# EAGLE design Adafruit SMT Datalogger Shield rev B (EAGLE 6.6.0)
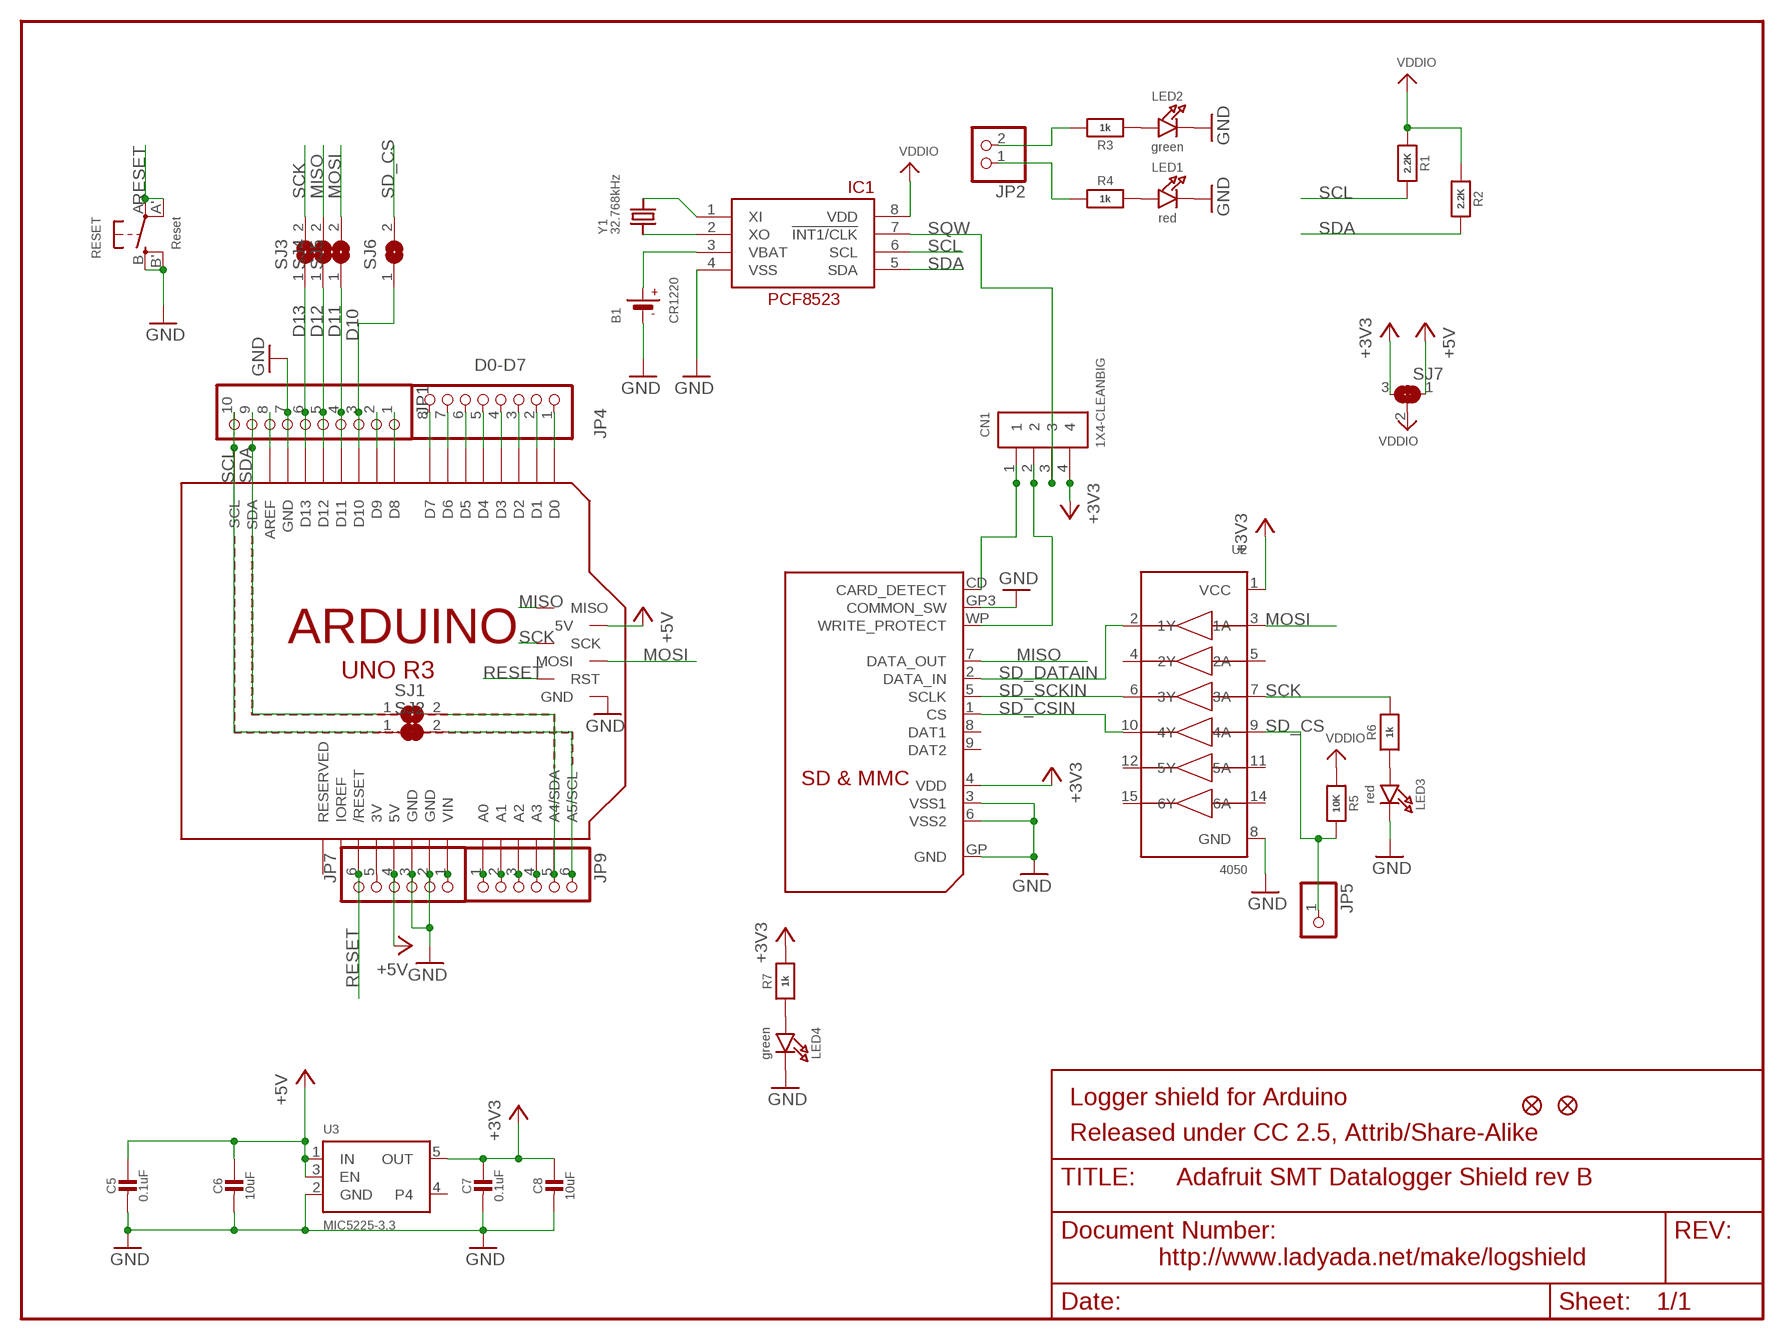
[diagram p0: schematic, sheet 1]

## Parts
B1  CR1220  BATTERYCR1220_SMT  [CR1220]
C5  0.1uF  CAP_CERAMIC0805-NOOUTLINE  [0805-NO]
C6  10uF  CAP_CERAMIC0805-NOOUTLINE  [0805-NO]
C7  0.1uF  CAP_CERAMIC0805-NOOUTLINE  [0805-NO]
C8  10uF  CAP_CERAMIC0805-NOOUTLINE  [0805-NO]
CN1  1X4-CLEANBIG  [1X04-CLEANBIG]
FID1  FIDUCIAL""  [FIDUCIAL_1MM]
FID3  FIDUCIAL""  [FIDUCIAL_1MM]
IC1  RTC_PCF8523T  [SOIC8_150MIL]
JP1  HEADER-1X1070MIL  [1X10_ROUND70]
JP2  HEADER-1X2ROUND  [1X02_ROUND]
JP4  D0-D7  PINHD-1X8BIG  [1X08-BIG]
JP5  HEADER-1X1ROUND  [1X01_ROUND]
JP7  PINHD-1X6B  [1X06-BIG]
JP9  PINHD-1X6B  [1X06-BIG]
LED1  red  LED0805_NOOUTLINE  [CHIPLED_0805_NOOUTLINE]
LED2  green  LED0805_NOOUTLINE  [CHIPLED_0805_NOOUTLINE]
LED3  red  LED0805_NOOUTLINE  [CHIPLED_0805_NOOUTLINE]
LED4  green  LED0805_NOOUTLINE  [CHIPLED_0805_NOOUTLINE]
M1  ARDUINO_R3_ICSP  [ARDUINOR3_ICSP]
R1  2.2K  RESISTOR0805_NOOUTLINE  [0805-NO]
R2  2.2K  RESISTOR0805_NOOUTLINE  [0805-NO]
R3  1k  RESISTOR0805_NOOUTLINE  [0805-NO]
R4  1k  RESISTOR0805_NOOUTLINE  [0805-NO]
R5  10K  RESISTOR0805_NOOUTLINE  [0805-NO]
R6  1k  RESISTOR0805_NOOUTLINE  [0805-NO]
R7  1k  RESISTOR0805_NOOUTLINE  [0805-NO]
RESET  Reset  SWITCH_TACT_SMT  [EVQ-Q2]
SJ1  SOLDERJUMPER  [SOLDERJUMPER_ARROW_NOPASTE]
SJ2  SOLDERJUMPER  [SOLDERJUMPER_ARROW_NOPASTE]
SJ3  SOLDERJUMPER  [SOLDERJUMPER_ARROW_NOPASTE]
SJ4  SOLDERJUMPER  [SOLDERJUMPER_ARROW_NOPASTE]
SJ5  SOLDERJUMPER  [SOLDERJUMPER_ARROW_NOPASTE]
SJ6  SOLDERJUMPERCLOSED  [SOLDERJUMPER_CLOSEDWIRE]
SJ7  SOLDERJUMPER_2WAY  [SOLDERJUMPER_2WAY_OPEN_NOPASTE]
U2  4050  74HC4050D  [SOIC16]
U3  MIC5225-3.3  VREG_SOT23-5  [SOT23-5]
U$2  SDMMC06132  [06132]
Y1  32.768kHz  CRYSTAL8.0X3.8  [CRYSTAL_8X3.8]

## Nets
3.3V: JP7.5 M1.3V
+3V3: C7.1 C8.1 CN1.4 R7.2 SJ7.3 U2.1(VCC) U3.5(OUT) U$2.4(VDD)
+5V: C5.1 C6.1 JP7.4 M1.5V M1.5V_ICSP(5V) SJ7.1 U3.1(IN) U3.3(EN)
A4: JP9.5 M1.A4(A4/SDA) SJ1.2
A5: JP9.6 M1.A5(A5/SCL) SJ2.2
D10: JP1.3 M1.D10 SJ6.1
D11: JP1.4 M1.D11 SJ5.1
D12: JP1.5 M1.D12 SJ4.1
D13: JP1.6 M1.D13 SJ3.1
GND: B1.- C5.2 C6.2 C7.2 C8.2 IC1.4(VSS) JP1.7 JP7.2 JP7.3 LED1.C LED2.C LED3.C LED4.C M1.GND M1.GND@1(GND) M1.GND@2(GND) M1.GND@3(GND) RESET.B'(S1) RESET.B(S) U2.8(GND) U3.2(GND) U$2.3(VSS1) U$2.6(VSS2) U$2.GP3(COMMON_SW) U$2.GP(GND)
MISO: M1.MISO SJ4.2 U$2.7(DATA_OUT)
MOSI: M1.MOSI SJ5.2 U2.3(1A)
N$1: LED1.A R4.2
N$2: IC1.2(XO) Y1.P$1
N$3: IC1.1(XI) Y1.P$4
N$4: LED2.A R3.1
N$5: LED3.A R6.1
N$15: JP7.1 M1.VIN
N$17: JP2.2 R3.2
N$20: JP2.1 R4.1
N$87: JP4.1 M1.D0
N$88: JP4.2 M1.D1
N$89: JP4.3 M1.D2
N$90: JP4.4 M1.D3
N$98: JP4.5 M1.D4
N$99: JP4.6 M1.D5
N$100: JP4.7 M1.D6
N$101: JP4.8 M1.D7
N$108: JP1.8 M1.AREF
N$110: JP1.2 M1.D9
N$111: JP1.1 M1.D8
N$150: LED4.A R7.1
N$154: JP9.1 M1.A0
N$164: JP9.2 M1.A1
N$181: JP9.3 M1.A2
N$182: JP9.4 M1.A3
RESET: JP7.6 M1.RESET(/RESET) M1.RESET_ICSP(RST) RESET.A'(P1) RESET.A(P)
SCK: M1.SCK R6.2 SJ3.2 U2.7(3A)
SCL: IC1.6(SCL) JP1.10 M1.SCL R1.2 SJ2.1
SD_CD: CN1.1 U$2.CD(CARD_DETECT)
SD_CS: JP5.1 R5.2 SJ6.2 U2.9(4A)
SD_CSIN: U2.10(4Y) U$2.1(CS)
SD_DATAIN: U2.2(1Y) U$2.2(DATA_IN)
SD_SCKIN: U2.6(3Y) U$2.5(SCLK)
SD_WP: CN1.2 U$2.WP(WRITE_PROTECT)
SDA: IC1.5(SDA) JP1.9 M1.SDA R2.2 SJ1.1
SQW: CN1.3 IC1.7(!INT1/CLK)
VBAT: B1.+$1(+) IC1.3(VBAT)
VDDIO: IC1.8(VDD) R1.1 R2.1 R5.1 SJ7.2
Unconnected: M1.IOREF M1.RESERVED U2.4(2Y) U2.5(2A) U2.11(5A) U2.12(5Y) U2.14(6A) U2.15(6Y) U3.4 U$2.8(DAT1) U$2.9(DAT2)

## Notes on the sheet
- Logger shield for Arduino
- Released under CC 2.5, Attrib/Share-Alike
- http://www.ladyada.net/make/logshield

## Library data of the parts
B1 = microbuilder:BATTERY: CR1220 SMT - Digikey: 3001K-ND CD2032 BAT-HLD-001 - Digikey: BAT-HLD-001-ND
C5-C8 = microbuilder:CAP_CERAMIC: Ceramic Capacitors For new designs, use the packages preceded by an '_' character since they are more reliable: The following footprints should be used on most boards: _0402 - Standard footprint for regular board layouts _0603 - Standard footprint for regular board layouts _0805 - Standard footprint for regular board layouts _1206 - Standard footprint for regular board layouts For extremely tight-pitch boards where space is at a premium, the following 'micro-pitch' footprints can be used (smaller pads, no silkscreen outline, etc.): _0402MP - Micro-pitch footprint for very dense/compact boards _0603MP - Micro-pitch footprint for very dense/compact boards _0805MP - Micro-pitch footprint for very dense/compact boards _1206MP - Micro-pitch footprint for very dense/compact boards
CN1 = adafruit:1X4: 4-pin connector
FID1 FID3 = microbuilder:FIDUCIAL: Fiducial Alignment Points Various fiducial points for machine vision alignment.; BOM: EXCLUDE
IC1 = microbuilder:RTC_PCF8523
JP1 = microbuilder:HEADER-1X10: PIN HEADER
JP2 = microbuilder:HEADER-1X2: PIN HEADER
JP4 = adafruit:PINHD-1X8: PIN HEADER
JP5 = microbuilder:HEADER-1X1: PIN HEADER
JP7 JP9 = adafruit:PINHD-1X6: PIN HEADER
LED1-LED4 = microbuilder:LED: LED 0603 - 0603 Surface Mount Package 2mA: Green LED - Low Power (3.9mcd, 2ma, 1.7Vf) - Digikey: 475-2709-2-ND Orange LED - Low Power (9.8mcd, 2ma, 1.8Vf) - Digikey: 475-1194-2-ND Red LED - Low Power (5mcd, 2ma, 1.8Vf) - Digikey: 475-1195-2-ND Yellow LED - Low Power (7mcd, 2ma, 1.8Vf) - Digikey: 475-1196-2-ND 5mA: Blue LED - Low Power (17mcd, 5ma, 2.9Vf) - Digikey: LNJ937W8CRACT-ND 0805 - 0805 Surface Mount Package 2mA: Red LED (8.8mcd, 2mA, 1.8Vf, Clear) - Low Power [Digikey: 475-2510-1-ND] Green LED (5mcd, 2mA, 1.8Vf, Clear) - Low Power [Digikey: 475-2730-1-ND] Yellow LED (11.3mcd, 2mA, 1.8Vf, Clear) - Low Power [Digikey: 475-2555-1-ND] 20mA: Red LED (104mcd, 20mA, Diffused) - LS R976 [Digikey: 475-1278-6-ND] Red LED (12mcd, 20mA, 2.0Vf, Clear) - APT2012EC [Digikey: 754-1128-1-ND] Green LED (15mcd, 20mA, 2.2Vf, Clear) - APT2012GC [Digikey: 754-1131-1-ND] Orange LED (160mcd, 20mA, 2.1Vf, Clear) - APT2012SECK [Digikey: 754-1130-1-ND] 1206 - 1206 Surface Mount Package Green LED (26mcd, 20mA, Diffused) - LG N971 [Digikey: 475-1407-6-ND] Red LED (15mcd, 20mA, Diffused) - LH N974 [Digikey: 475-1416-6-ND] Cree - Cree High-Power Surface Mount LEDs XPEBWT-L1-0000-00D50 - White 111lm 350mA 2.9Vf 6200K 110° XTEAWT-00-0000-00000LEE3 - White 114lm 350mA 2.85Vf 5000K 115° Everlight - Everlight 45-21 Series Surface Mount LEDs 45-21/QK2C-B2832AC2CB2/2T - Warm White 2000mcd 20mA 3.25Vf 3050K 120° 45-21/LK2C-B38452C4CB2/2T - Nuetral White 2000mcd 20mA 3.25Vf 4150K 120° 45-21/LK2C-B50634C6CB2/2T - Cold White 2200mcd 20mA 3.25Vf 5650K 120° PLCC2 Reverse Mount LS T77K-J1L2-1-0-2-R18-Z - Red 11.25mcd 2mA 1.8Vf 630nm 120° LO T77K-L1M2-24-Z - Orange 19.6mcd 2mA 1.8Vf 606nm 120° LY T77K-K2M1-26-Z - Yellow 15.7mcd 2mA 1.8Vf 587nm 120°
M1 = adafruit:ARDUINO_R3_ICSP
R1-R7 = microbuilder:RESISTOR: Resistors For new designs, use the packages preceded by an '_' character since they are more reliable: The following footprints should be used on most boards: _0402 - Standard footprint for regular board layouts _0603 - Standard footprint for regular board layouts _0805 - Standard footprint for regular board layouts _1206 - Standard footprint for regular board layouts For extremely tight-pitch boards where space is at a premium, the following 'micro-pitch' footprints can be used (smaller pads, no silkscreen outline, etc.): _0402MP - Micro-pitch footprint for very dense/compact boards _0603MP - Micro-pitch footprint for very dense/compact boards _0805MP - Micro-pitch footprint for very dense/compact boards _1206MP - Micro-pitch footprint for very dense/compact boards
RESET = microbuilder:SWITCH_TACT_SMT: SMT Tact Switches 6x6mm - Digikey: P12940SCT-ND KMR2 (4.6x2.8mm) - Digikey: 401-1426-1-ND EVQ-PQHB55 - Light Touch, 160GF (4.5x4.5mm) - Digikey: P8090SCT-ND KMT0 - KMT021 NGJ LHS (etc.) IP68/Waterproof - Digikey: CKN10289CT-ND
SJ1-SJ5 = microbuilder:SOLDERJUMPER: SMD Solder JUMPER Solder the two pads together to create a connection, or remove the solder to break it. REFLOW - Use this footprint for solder paste and reflow ovens. WAVE - Use this footprint for hand-soldering (larger pads). CLOSED - Has a trace between the two pads to ensure it is closed by default. The trace needs to be cut to disable the jumper, and can be closed again by creating a solder bridge between the two pads.; BOM: EXCLUDE
SJ6 = microbuilder:SOLDERJUMPER: SMD Solder JUMPER Solder the two pads together to create a connection, or remove the solder to break it. REFLOW - Use this footprint for solder paste and reflow ovens. WAVE - Use this footprint for hand-soldering (larger pads). CLOSED - Has a trace between the two pads to ensure it is closed by default. The trace needs to be cut to disable the jumper, and can be closed again by creating a solder bridge between the two pads.
SJ7 = microbuilder:SOLDERJUMPER_2WAY: 2-Way Solder Jumper
U2 = microbuilder:74HC4050D: 6-channel level shifter 74HC4050D - 2V-6V Supply SOIC16 Digikey: 74HC4050D,653-ND Mouser: 771-74HC4050D-T TSSOP16 Digikey: 296-9215-1-ND Mouser:
U3 = microbuilder:VREG_SOT23-5: SOT23-5 Fixed Voltage Regulators Part Current Out V Out V In V Dropout θJA (°C/W) TJ (°C) Digikey Part No. ADP121 150mA 3.3V 3.4-5.5V 0.09V @ 150mA -- -- ADP121-AUJZ33R7CT-ND ADP121 150mA 3.0V 3.1-5.5V 0.09V @ 150mA -- -- ADP121-AUJZ30R7CT-ND ADP122 300mA 3.3V 3.4-5.5V 0.085V @ 300mA -- -- ADP122AUJZ-3.3-R7CT-ND ADP1712 300mA 3.3V 3.5-5.5V 0.17V @ 300mA -- -- ADP1712AUJZ-3.3-R7TR-ND AP7311 (Low Cost) 150mA 3.3V 3.5-6V 0.15V @ 150mA -- -- AP7311-33WG-7DICT-ND LD39015M18R 150mA 1.8V 1.9V-5.5V 0.08V @ 100mA -- -- 497-6977-1-ND LP2985A-33DBVR 150mA 3.3V 3.3-16V 0.28V @ 150mA 206 150 296-18479-1-ND MCP1824T-3302E/OT 300mA 3.3V 3.5V-6V 0.2V @ 300mA -- -- MCP1824T-3302E/OTCT-ND MIC5205-2.5YM5 TR 150mA 2.5V 2.7-16V 0.165V @ 150mA -- -- 576-1257-2-ND MIC5205-3.0YM5 TR 150mA 3.0V 3.2V-16V 0.165V @ 150mA -- -- 576-1258-2-ND MIC5205-3.3YM5 TR 150mA 3.3V 3.5V-16V 0.165V @ 150mA -- -- 576-1259-2-ND TPS780330220 150mA 3.3V+2.2V 3.6-5.5V 250mV Max -- -- 296-23332-1-ND TDA3663/N1,135 100mA 3.3V 3.5-45V 0.18V @ 50mA -- -- 568-5343-1-ND Max operating temp can be calculated using θJA, TJ (max junction temperature), and power in watts. Set the "Maximum Ambient Temperature" until it reaches TJ ("Max Junction Temperature"), which is the absolute limit for safe use of the regulator: Heat Sink Temperature Calculator <http://www.daycounter.com/Calculators/Heat-Sink-Temperature-Calculator.phtml> For example, With 12V source into a 3.3V LP2985 and a 30mA load, we are dissipating (12V-3.3V) * 0.03A = 0.261W. With a θJA of 206 °C/W, a TJ of 150°C, and 261mW we can safely use the chip without a heat sink up to 75°C (=147.1°C Junction Temperature).
U$2 = microbuilder:SDMMC: SD MMC Card holder 4UCON part #06132 - easy to solder
Y1 = microbuilder:CRYSTAL: Crystals HC49UP - Surface Mount Crystal 4.0MHz 18pF +/-30ppm Surface Mount Crystal [Digikey: 535-9857-1-ND] 12.0 MHz Surface Mount Crystal [Digikey: 535-9869-6-ND] 25.0 MHz Surface Mount Crystal [Digikey: 535-9078-1-ND] 2.5 x 2.0mm - MEMs SMT Crystal 16.0 MHz 10pF 20ppm 2.5 x 2.0mm Crystal [Digikey -40-85°C: 535-10923-1-ND] 3.2 x 2.5mm - MEMs SMT Crystal 12.0 MHz 8pF 15ppm 3.2 x 2.5mm Crystal [Digikey: -10-70°C: 644-1047-1-ND -40-125°C: 644-1128-1-ND] 40~85°C cheaper: 644-1173-6-ND 16.0 MHz 8pF 15ppm 3.2 x 2.5mm Crystal [Digikey: -10-70°C: 644-1049-1-ND -40-125°C: 644-1129-2-ND]-40~85°C cheaper: 644-1175-6-ND 16.0 MHz 10pF 10ppm 3.2 x 2.5mm Crystal [Digikey: 644-1100-1-ND] 27.12 MHz 18pF 30ppm 3.2 x 2.5mm Crystal [Digikey: 887-1424-1-ND] 27.12MHz 10pF 10ppm 3.2 x 2.5mm Crystal [Digikey: 887-1329-1-ND] 4.9 x 1.8mm - MEMs SMT Crystal 32.768 KHz 12.5pF 20ppm 4.9 x 1.8mm Crystal [Digikey: SE2415CT-ND] 8.0 x 3.8mm - Surface Mount Crystal 32.768kHz 12.5pF 20ppm -40°C-85°C [Digikey: 535-9166-2-ND] Cylinder 32.768KHz Cylinder Crystal (2x6mm body) [Ex. Digikey: 300-8341-2-ND]

## Board
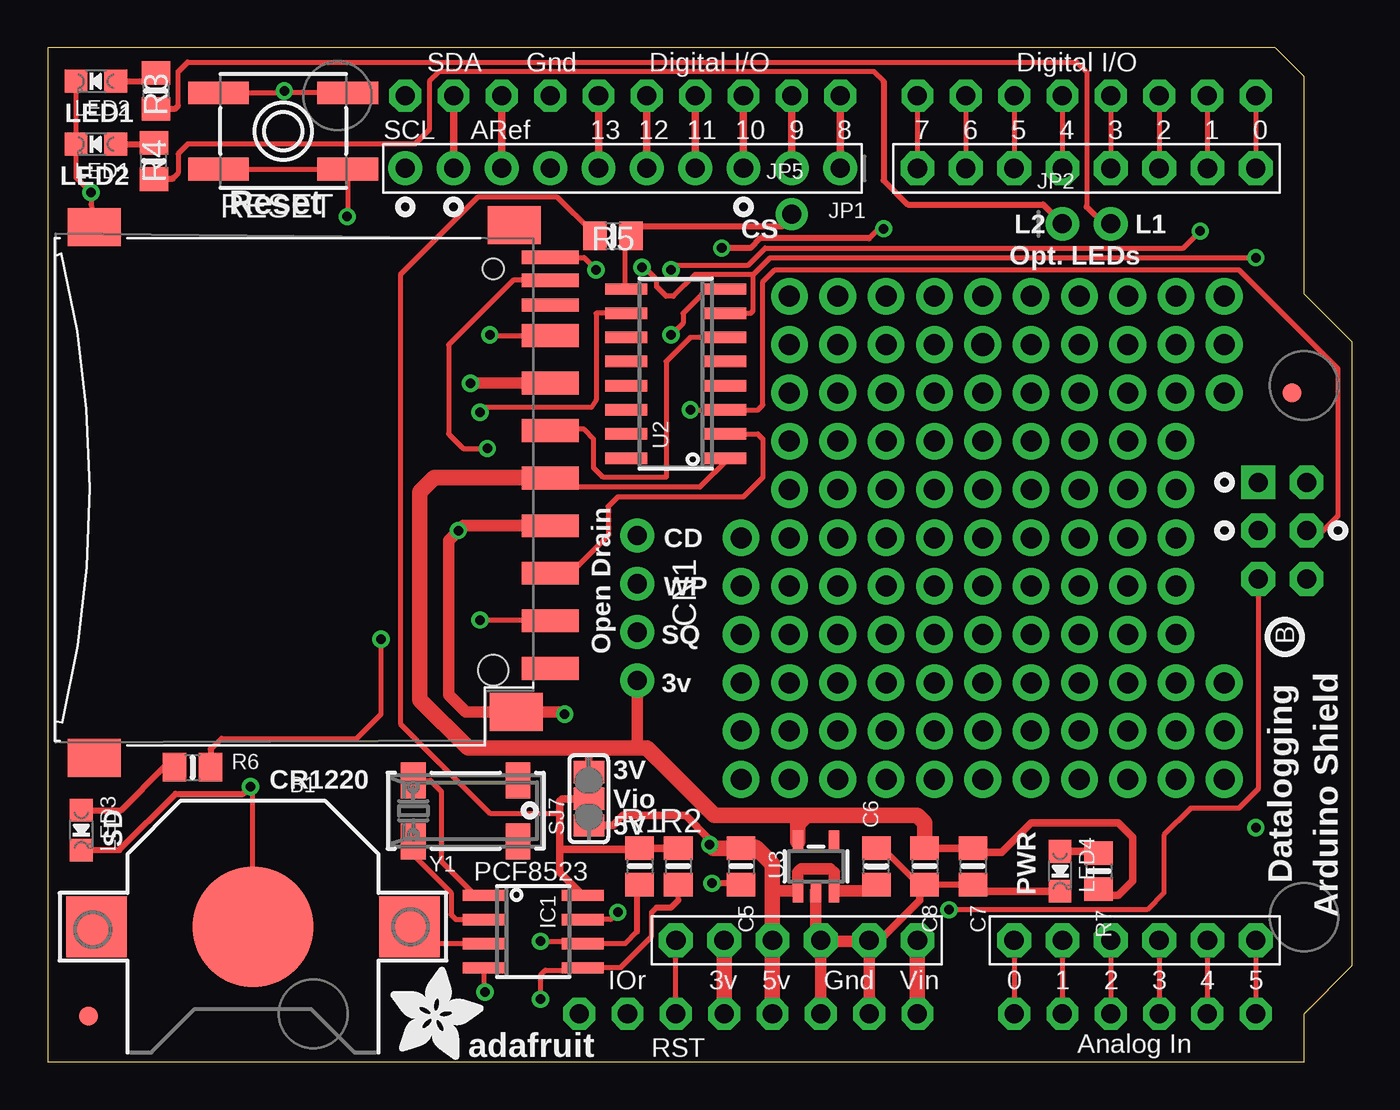
[diagram p1: board, top side]
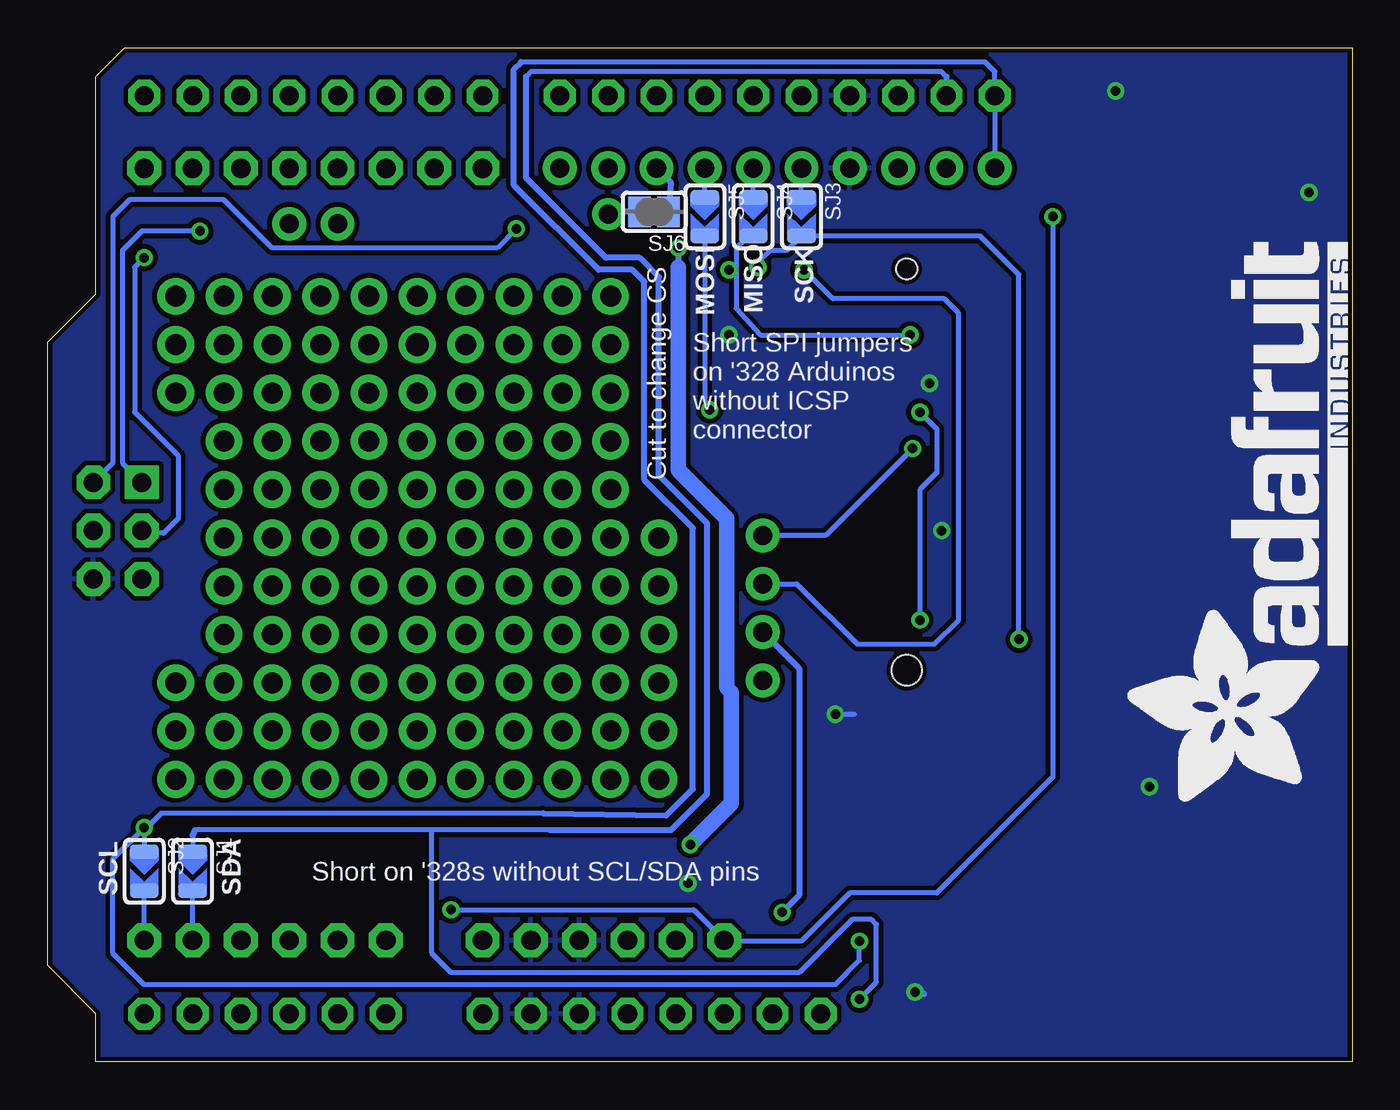
[diagram p2: board, bottom side, seen from below]

Size 68.58 x 53.34 mm. Coordinates in mm from the lower left corner, seen from the top.
Copper layers (1*16): Top 0.035mm / dielectric 1.5mm / Bottom 0.035mm
Design rules "adafruit": minimum track width 8mil, minimum drill 15.5mil, track to track 8mil, track to pad 8mil, pad to pad 8mil, via to via 8mil, smd to smd 8mil, copper to edge 10mil, drill to drill 8mil, minimum pad ring 10mil, minimum via ring 8mil, stop-mask expansion 2mil, vias tented up to drill 20mil, thermal gap 10mil

### Footprints (pad centres in the part's own frame; a part is rotated, then mirrored left to right if it is on the bottom)
CR1220 = smd 3.2 x 3.2: +$1 -8.225,0; +$2 8.225,0 | smd 6.35 x 6.35: - 0,0
0805-NO = smd 1.24 x 1.5: 1 -0.95,0; 2 0.95,0
1X04-CLEANBIG = drill 1.016 pad 1.778: 1 -3.81,0; 2 -1.27,0; 3 1.27,0; 4 3.81,0
FIDUCIAL_1MM = smd 1 x 1: 1 0,0
SOIC8_150MIL = smd 0.6 x 2.2: 1 -1.905,-2.6; 2 -0.635,-2.6; 3 0.635,-2.6; 4 1.905,-2.6; 5 1.905,2.6; 6 0.635,2.6; 7 -0.635,2.6; 8 -1.905,2.6
1X10_ROUND70 = drill 1 pad 1.778: 1 -11.43,0; 2 -8.89,0; 3 -6.35,0; 4 -3.81,0; 5 -1.27,0; 6 1.27,0; 7 3.81,0; 8 6.35,0; 9 8.89,0; 10 11.43,0
1X02_ROUND = drill 1 pad 1.778: 1 -1.27,0; 2 1.27,0
1X08-BIG = drill 1.016 pad 1.778 octagon: 1 -8.89,0; 2 -6.35,0; 3 -3.81,0; 4 -1.27,0; 5 1.27,0; 6 3.81,0; 7 6.35,0; 8 8.89,0
1X01_ROUND = drill 1 pad 1.676: 1 0,0
1X06-BIG = drill 1.016 pad 1.778 octagon: 1 -6.35,0; 2 -3.81,0; 3 -1.27,0; 4 1.27,0; 5 3.81,0; 6 6.35,0
CHIPLED_0805_NOOUTLINE = smd 1.2 x 1.2: A 0,-1.05; C 0,1.05
ARDUINOR3_ICSP = drill 1 pad 1.676 octagon: 3V 35.56,2.54; 5V 38.1,2.54; A0 50.8,2.54; A1 53.34,2.54; A2 55.88,2.54; A3 58.42,2.54; A4 60.96,2.54; A5 63.5,2.54; AREF 23.876,50.8; D0 63.5,50.8; D1 60.96,50.8; D2 58.42,50.8; D3 55.88,50.8; D4 53.34,50.8; D5 50.8,50.8; D6 48.26,50.8; D7 45.72,50.8; D8 41.656,50.8; D9 39.116,50.8; D10 36.576,50.8; D11 34.036,50.8; D12 31.496,50.8; D13 28.956,50.8; GND 26.416,50.8; GND@1 43.18,2.54; GND@2 40.64,2.54; IOREF 30.48,2.54; RESERVED 27.94,2.54; RESET 33.02,2.54; SCL 18.796,50.8; SDA 21.336,50.8; VIN 45.72,2.54 | drill 1 pad 1.778 octagon: 5V_ICSP 66.167,30.48; GND@3 66.167,25.4; MOSI 66.167,27.94; RESET_ICSP 63.627,25.4; SCK 63.627,27.94 | drill 1 pad 1.778 square: MISO 63.627,30.48
EVQ-Q2 = smd 3.2 x 1.2: A -3.4,-2; A' 3.4,-2; B -3.4,2; B' 3.4,2
SOLDERJUMPER_ARROW_NOPASTE = smd 0.762 x 1.524: 1 -1.016,0; 2 1.016,0
SOLDERJUMPER_CLOSEDWIRE = smd 1.168 x 1.6: 1 -0.762,0; 2 0.762,0 | smd 0.635 x 0.203: WIRE 0,0
SOLDERJUMPER_2WAY_OPEN_NOPASTE = smd 1.168 x 1.6: 1 -1.397,0; 2 0,0; 3 1.397,0
SOIC16 = smd 0.6 x 2.2: 1 -4.445,-2.6; 2 -3.175,-2.6; 3 -1.905,-2.6; 4 -0.635,-2.6; 5 0.635,-2.6; 6 1.905,-2.6; 7 3.175,-2.6; 8 4.445,-2.6; 9 4.445,2.6; 10 3.175,2.6; 11 1.905,2.6; 12 0.635,2.6; 13 -0.635,2.6; 14 -1.905,2.6; 15 -3.175,2.6; 16 -4.445,2.6
SOT23-5 = smd 0.55 x 1.2: 1 -0.95,-1.3; 2 0,-1.3; 3 0.95,-1.3; 4 0.95,1.3; 5 -0.95,1.3
06132 = smd 1.2 x 3: 1 6.9,0.9; 2 4.4,0.9; 3 1.9,0.9; 4 -0.6,0.9; 5 -3.1,0.9; 6 -5.6,0.9; 7 -8.1,0.9; 9 9.4,0.9 | smd 0.7 x 3: 8 -9.7,0.9; CD -11,0.9; WP -12.2,0.9 | smd 2 x 2.8: GP -13.8,-23.07; GP2 14.1,-23.07; GP3 11.7,-0.9; GP4 -13.9,-1 | hole 1.1: -11.6,-2.1 | hole 1.6: 9.5,-2.1
CRYSTAL_8X3.8 = smd 1.3 x 1.9: P$1 -2.75,-1.6; P$2 2.75,-1.6; P$3 2.75,1.6; P$4 -2.75,1.6

### Placement (x,y rotation side)
B1  10.79,7.11 180 top
C5  36.45,10.29 270 top
C6  43.56,10.29 90 top
C7  48.64,10.29 270 top
C8  46.1,10.29 270 top
CN1  30.99,23.88 270 top
FID1  2.16,2.41 0 top
FID3  65.41,35.18 0 top
IC1  25.53,6.86 270 top
JP1  30.23,46.99 180 top
JP2  54.61,44.07 0 top
JP4  54.61,46.99 180 top
JP5  39.12,44.58 0 top
JP7  39.37,6.4 180 top
JP9  57.15,6.4 0 top
LED1  2.54,48.26 90 top
LED2  2.54,51.56 90 top
LED3  1.78,12.19 180 top
LED4  53.21,10.03 180 top
M1  0,0 0 top
R1  31.11,10.29 270 top
R2  33.15,10.29 270 top
R3  5.69,51.06 270 top
R4  5.59,47.37 90 top
R5  29.72,43.43 0 top
R6  7.62,15.49 0 top
R7  55.24,10.03 270 top
RESET  12.39,48.95 0 top
SJ1  60.96,10.03 270 bottom
SJ2  63.5,10.03 270 bottom
SJ3  28.96,44.45 270 bottom
SJ4  31.5,44.45 270 bottom
SJ5  34.04,44.45 270 bottom
SJ6  36.7,44.7 180 bottom
SJ7  28.45,13.84 90 top
U2  33.02,36.2 90 top
U3  40.39,10.29 0 top
U$1  [ADAFRUIT_TEXT_30MM]  0.25,13.46 90 bottom
U$2  25.53,30.1 270 top
U$3  [PCBFEAT-REV-040]  65.02,22.35 90 top
U$5  [ADAFRUIT_5MM]  18.03,0.13 0 top
Y1  21.97,13.21 0 top

### Tracks (layer width: path | path; a pad name or v marks a point on that pad's centre or on a via)
3.3V
  Top 0.813: JP7.5 M1.3V
+3V3
  Top 0.254: U$2.4 26.21,30.73 27.18,30.73 27.69,30.23 34.29,30.23 35.75,31.68 U2.1
  Top 0.406: C8.1 C7.1 48.84,11.03 50.15,11.03 51.69,12.57 56.26,12.57 57.02,11.81 57.02,9.53 56.26,8.76 55.56,8.76 R7.2 | SJ7.3 28.45,16.51
  Top 0.61: CN1.4 30.99,16.51
  Top 0.813: 39.88,12.95 45.72,12.95 46.1,12.57 C8.1 | 39.88,12.95 39.44,12.51 U3.5 | 26.21,30.73 20.32,30.73 19.56,29.97 19.56,19.05 22.1,16.51 28.45,16.51 30.99,16.51 31.5,16.51 35.05,12.95 39.88,12.95
+5V  (via drill 0.5)
  Top 0.254: 43.18,43.31 43.69,43.81 v43.94,43.81
  Top 0.305: 37.22,11.29 37.17,11.24 C5.1 | 43.18,43.31 37.47,43.31 36.96,42.8 35.49,42.8 v35.43,42.8
  Top 0.406: SJ7.1 29.72,12.45 30.23,12.95 33.53,12.95 34.8,11.68 v34.8,11.43
  Top 0.61: 38.2,8.99 U3.1 39.44,9.97 39.62,10.16 41.15,10.16 41.34,9.97 U3.3 43.21,8.99 C6.1
  Top 0.813: M1.5V JP7.4 38.1,8.89 | 38.1,8.89 38.1,10.41 37.22,11.29 | 38.2,8.99 38.1,8.89 | C5.1 34.99,11.24 v34.8,11.43
  Bottom 0.254: M1.5V_ICSP 65.15,31.5 65.15,44.45 64.26,45.34 59.31,45.34 56.77,42.8 44.96,42.8 v43.94,43.81
  Bottom 0.305: v35.43,42.8 35.43,41.78
  Bottom 0.813: v34.8,11.43 32.64,13.59 32.64,19.43 32.89,19.68 32.89,28.57 35.43,31.11 35.43,41.78
A4
  Top 0.254: JP9.5 M1.A4
  Bottom 0.254: JP9.5 SJ1.2
A5
  Top 0.254: JP9.6 M1.A5
  Bottom 0.254: JP9.6 SJ2.2
D10
  Top 0.254: 36.7,46.91 36.65,46.91 JP1.3
  Top 0.406: M1.D10 JP1.3
  Bottom 0.305: SJ6.1 35.81,46.23 JP1.3
D11
  Top 0.406: M1.D11 JP1.4
  Bottom 0.254: SJ5.1 JP1.4
D12
  Top 0.406: JP1.5 M1.D12
  Bottom 0.254: SJ4.1 JP1.5
D13
  Top 0.406: JP1.6 M1.D13
  Bottom 0.254: SJ3.1 JP1.6
GND  (via drill 0.5)
  Top 0.254: 22.21,35.7 v22.23,35.69 | B1.- 10.79,14.35 v10.67,14.48 | 40.39,6.66 JP7.3 | LED2.C LED1.C 1.49,46.52 v2.29,45.72 2.29,45.09 U$2.GP | RESET.B 12.35,50.95 v12.45,51.05 12.55,50.95 RESET.B' | U2.8 34.67,40.64 33.4,39.37 33.4,38.86 v32.77,38.23 | IC1.4 22.93,3.74 v22.99,3.68
  Top 0.305: LED3.C 3.78,11.14 6.73,14.1 10.29,14.1 v10.67,14.48 | C5.2 35.88,9.4 v34.92,9.4 | C7.2 C8.2 45.78,9.66 45.46,9.66 44.07,11.05 43.75,11.05 C6.2
  Top 0.406: 53.16,9.03 LED4.C 48.99,8.98 C7.2 | JP7.2 43.74,6.4 45.85,8.51 45.85,9.08 C8.2
  Top 0.61: U$2.6 22.21,35.7 | U$2.3 21.85,28.2 v21.59,27.94 21.08,27.43 21.08,19.3 21.99,18.4 U$2.GP3 27.07,18.4 v27.18,18.29 | U3.2 40.39,6.66 | M1.GND@2 JP7.3 40.69,6.35 43.18,6.35 M1.GND@1
  Bottom 0.254: v2.29,45.72 2.54,45.72 | v22.23,35.69 21.97,35.69 | v21.59,27.94 21.59,27.69 | v27.18,18.29 26.16,18.29 | v10.67,14.48 10.67,14.73 | v12.45,51.05 12.7,51.05 | v32.77,38.23 32.64,38.1 | v22.99,3.68 22.61,3.68 22.48,3.56
  Bottom 0.305: v34.92,9.4 34.67,9.27
  pour Bottom (isolate 0.254): 0,0 0,53.34 68.58,53.34 68.58,0
MISO  (via drill 0.5)
  Top 0.254: v23.24,38.23 23.27,38.2 U$2.7 | v32.77,41.66 33.02,41.91 36.83,41.91 37.72,42.8 59.69,42.8 v60.58,43.69
  Bottom 0.254: SJ4.2 31.75,43.43 32.38,42.8 32.38,41.66 | 32.38,41.66 32.38,39.62 31.11,38.23 v23.24,38.23 | 32.38,41.66 v32.77,41.66 | v60.58,43.69 63.63,43.69 64.64,42.67 64.64,31.5 M1.MISO
MOSI  (via drill 0.5)
  Top 0.254: M1.MOSI 67.06,27.94 67.82,28.7 67.82,36.45 62.61,41.66 38.23,41.66 37.59,41.02 37.59,34.54 37.34,34.29 U2.3 v33.78,34.29
  Bottom 0.254: SJ5.2 34.04,34.8 v33.78,34.29
N$1
  Top 0.305: LED1.A 5.53,48.26 R4.2
N$2
  Top 0.254: Y1.P$1 19.22,10.88 21.21,8.89 21.21,7.75 21.46,7.49 IC1.2
N$3
  Top 0.254: Y1.P$4 20.12,14.81 20.7,14.22 20.7,10.54 22.48,8.76 IC1.1
N$4
  Top 0.305: LED2.A 5.24,51.56 R3.1
N$5
  Top 0.305: LED3.A 3.86,13.24 6.11,15.49 R6.1
N$6  (via drill 1.1 pad 1.93)
  other vias: 51.69,37.72
N$7  (via drill 1.1 pad 1.93)
  other vias: 46.61,37.72
N$8  (via drill 1.1 pad 1.93)
  other vias: 44.07,35.18
N$9  (via drill 1.1 pad 1.93)
  other vias: 54.23,37.72
N$10  (via drill 1.1 pad 1.93)
  other vias: 44.07,32.64
N$11  (via drill 1.1 pad 1.93)
  other vias: 56.77,35.18
N$12  (via drill 1.1 pad 1.93)
  other vias: 44.07,17.4
N$15
  Top 0.813: JP7.1 M1.VIN
N$16  (via drill 1.1 pad 1.93)
  other vias: 56.77,37.72
N$17
  Top 0.254: 6.86,50.29 6.86,52.07 7.37,52.58 54.1,52.58 54.61,52.07 54.61,44.96
  Top 0.305: 54.61,44.96 55.5,44.07 JP2.2 | 6.86,50.29 6.68,50.11 R3.2
N$18  (via drill 1.1 pad 1.93)
  other vias: 44.07,30.1
N$19  (via drill 1.1 pad 1.93)
  other vias: 59.31,37.72
N$20
  Top 0.254: 43.94,51.56 43.43,52.07 20.57,52.07 20.07,51.56 20.07,49.02 19.3,48.26 7.37,48.26 6.86,47.75 6.86,46.74 6.6,46.48
  Top 0.305: 43.94,51.56 43.94,46.35 45.21,45.09 52.32,45.09 JP2.1 | 6.6,46.48 6.54,46.42 R4.1
N$24  (via drill 1.1 pad 1.93)
  other vias: 61.85,35.18
N$25  (via drill 1.1 pad 1.93)
  other vias: 59.31,35.18
N$27  (via drill 1.1 pad 1.93)
  other vias: 54.23,35.18
N$28  (via drill 1.1 pad 1.93)
  other vias: 51.69,35.18
N$29  (via drill 1.1 pad 1.93)
  other vias: 49.15,35.18
N$30  (via drill 1.1 pad 1.93)
  other vias: 46.61,35.18
N$31  (via drill 1.2 pad 1.93)
  other vias: 49.15,37.72
N$32  (via drill 1.1 pad 1.93)
  other vias: 49.15,32.64
N$33  (via drill 1.1 pad 1.93)
  other vias: 51.69,32.64
N$34  (via drill 1.1 pad 1.93)
  other vias: 54.23,32.64
N$35  (via drill 1.1 pad 1.93)
  other vias: 56.77,32.64
N$36  (via drill 1.1 pad 1.93)
  other vias: 59.31,32.64
N$37  (via drill 1.1 pad 1.93)
  other vias: 61.85,14.86
N$42  (via drill 1.1 pad 1.93)
  other vias: 46.61,30.1
N$43  (via drill 1.1 pad 1.93)
  other vias: 49.15,30.1
N$44  (via drill 1.1 pad 1.93)
  other vias: 51.69,30.1
N$45  (via drill 1.1 pad 1.93)
  other vias: 54.23,30.1
N$46  (via drill 1.1 pad 1.93)
  other vias: 56.77,30.1
N$47  (via drill 1.1 pad 1.93)
  other vias: 59.31,30.1
N$51  (via drill 1.1 pad 1.93)
  other vias: 54.23,14.86
N$56  (via drill 1.1 pad 1.93)
  other vias: 59.31,27.56
N$57  (via drill 1.1 pad 1.93)
  other vias: 56.77,27.56
N$58  (via drill 1.1 pad 1.93)
  other vias: 54.23,27.56
N$59  (via drill 1.1 pad 1.93)
  other vias: 51.69,27.56
N$60  (via drill 1.1 pad 1.93)
  other vias: 49.15,27.56
N$61  (via drill 1.1 pad 1.93)
  other vias: 46.61,27.56
N$64  (via drill 1.1 pad 1.93)
  other vias: 61.85,19.94
N$66  (via drill 1.1 pad 1.93)
  other vias: 46.61,25.02
N$67  (via drill 1.1 pad 1.93)
  other vias: 49.15,25.02
N$68  (via drill 1.1 pad 1.93)
  other vias: 51.69,25.02
N$69  (via drill 1.1 pad 1.93)
  other vias: 54.23,25.02
N$70  (via drill 1.1 pad 1.93)
  other vias: 56.77,25.02
N$71  (via drill 1.1 pad 1.93)
  other vias: 59.31,25.02
N$74  (via drill 1.1 pad 1.93)
  other vias: 61.85,37.72
N$75  (via drill 1.1 pad 1.93)
  other vias: 59.31,14.86
N$76  (via drill 1.1 pad 1.93)
  other vias: 56.77,14.86
N$77  (via drill 1.1 pad 1.93)
  other vias: 49.15,14.86
N$78  (via drill 1.1 pad 1.93)
  other vias: 46.61,22.48
N$79  (via drill 1.1 pad 1.93)
  other vias: 49.15,22.48
N$80  (via drill 1.1 pad 1.93)
  other vias: 51.69,22.48
N$81  (via drill 1.1 pad 1.93)
  other vias: 54.23,22.48
N$82  (via drill 1.1 pad 1.93)
  other vias: 56.77,22.48
N$83  (via drill 1.1 pad 1.93)
  other vias: 59.31,22.48
N$85  (via drill 1.1 pad 1.93)
  other vias: 46.61,14.86
N$86  (via drill 1.1 pad 1.93)
  other vias: 51.69,14.86
N$87
  Top 0.254: M1.D0 JP4.1
N$88
  Top 0.254: M1.D1 JP4.2
N$89
  Top 0.254: M1.D2 JP4.3
N$90
  Top 0.254: M1.D3 JP4.4
N$92  (via drill 1.1 pad 1.93)
  other vias: 59.31,19.94
N$93  (via drill 1.1 pad 1.93)
  other vias: 56.77,19.94
N$94  (via drill 1.1 pad 1.93)
  other vias: 54.23,19.94
N$95  (via drill 1.1 pad 1.93)
  other vias: 51.69,19.94
N$96  (via drill 1.1 pad 1.93)
  other vias: 49.15,19.94
N$97  (via drill 1.1 pad 1.93)
  other vias: 46.61,19.94
N$98
  Top 0.254: M1.D4 JP4.5
N$99
  Top 0.254: M1.D5 JP4.6
N$100
  Top 0.254: M1.D6 JP4.7
N$101
  Top 0.254: M1.D7 JP4.8
N$102  (via drill 1.1 pad 1.93)
  other vias: 46.61,17.4
N$103  (via drill 1.1 pad 1.93)
  other vias: 49.15,17.4
N$104  (via drill 1.1 pad 1.93)
  other vias: 51.69,17.4
N$105  (via drill 1.1 pad 1.93)
  other vias: 54.23,17.4
N$106  (via drill 1.1 pad 1.93)
  other vias: 56.77,17.4
N$107  (via drill 1.1 pad 1.93)
  other vias: 59.31,17.4
N$108
  Top 0.406: JP1.8 M1.AREF
N$109  (via drill 1.1 pad 1.93)
  other vias: 61.85,17.4
N$110
  Top 0.406: M1.D9 JP1.2
N$111
  Top 0.406: M1.D8 JP1.1
N$112  (via drill 1.1 pad 1.93)
  other vias: 44.07,27.56
N$113  (via drill 1.1 pad 1.93)
  other vias: 44.07,25.02
N$114  (via drill 1.1 pad 1.93)
  other vias: 44.07,22.48
N$115  (via drill 1.1 pad 1.93)
  other vias: 44.07,19.94
N$116  (via drill 1.1 pad 1.93)
  other vias: 44.07,14.86
N$118  (via drill 1.1 pad 1.93)
  other vias: 44.07,37.72
N$119  (via drill 1.1 pad 1.93)
  other vias: 41.53,35.18
N$120  (via drill 1.1 pad 1.93)
  other vias: 41.53,32.64
N$121  (via drill 1.1 pad 1.93)
  other vias: 41.53,30.1
N$122  (via drill 1.1 pad 1.93)
  other vias: 41.53,27.56
N$123  (via drill 1.1 pad 1.93)
  other vias: 41.53,25.02
N$124  (via drill 1.1 pad 1.93)
  other vias: 41.53,22.48
N$125  (via drill 1.1 pad 1.93)
  other vias: 41.53,19.94
N$126  (via drill 1.1 pad 1.93)
  other vias: 41.53,17.4
N$127  (via drill 1.1 pad 1.93)
  other vias: 41.53,14.86
N$128  (via drill 1.1 pad 1.93)
  other vias: 38.99,17.4
N$129  (via drill 1.1 pad 1.93)
  other vias: 38.99,19.94
N$130  (via drill 1.1 pad 1.93)
  other vias: 38.99,22.48
N$131  (via drill 1.1 pad 1.93)
  other vias: 38.99,25.02
N$132  (via drill 1.1 pad 1.93)
  other vias: 38.99,27.56
N$133  (via drill 1.1 pad 1.93)
  other vias: 36.45,27.56
N$134  (via drill 1.1 pad 1.93)
  other vias: 36.45,25.02
N$135  (via drill 1.1 pad 1.93)
  other vias: 36.45,22.48
N$136  (via drill 1.1 pad 1.93)
  other vias: 36.45,19.94
N$137  (via drill 1.1 pad 1.93)
  other vias: 36.45,17.4
N$139  (via drill 1.1 pad 1.93)
  other vias: 61.85,40.26
N$140  (via drill 1.1 pad 1.93)
  other vias: 59.31,40.26
N$141  (via drill 1.1 pad 1.93)
  other vias: 56.77,40.26
N$142  (via drill 1.1 pad 1.93)
  other vias: 54.23,40.26
N$143  (via drill 1.1 pad 1.93)
  other vias: 51.69,40.26
N$144  (via drill 1.1 pad 1.93)
  other vias: 49.15,40.26
N$145  (via drill 1.1 pad 1.93)
  other vias: 46.61,40.26
N$146  (via drill 1.1 pad 1.93)
  other vias: 44.07,40.26
N$147  (via drill 1.1 pad 1.93)
  other vias: 41.53,40.26
N$148  (via drill 1.1 pad 1.93)
  other vias: 38.99,30.1
N$150
  Top 0.406: LED4.A 55.15,11.08 R7.1
N$151  (via drill 1.1 pad 1.93)
  other vias: 38.99,40.26
N$152  (via drill 1.1 pad 1.93)
  other vias: 38.99,37.72
N$153  (via drill 1.1 pad 1.93)
  other vias: 38.99,35.18
N$154
  Top 0.254: JP9.1 M1.A0
N$155  (via drill 1.1 pad 1.93)
  other vias: 38.99,32.64
N$156  (via drill 1.1 pad 1.93)
  other vias: 46.61,32.64
N$157  (via drill 1.1 pad 1.93)
  other vias: 38.99,14.86
N$158  (via drill 1.1 pad 1.93)
  other vias: 36.45,14.86
N$159  (via drill 1.1 pad 1.93)
  other vias: 41.53,37.72
N$164
  Top 0.254: JP9.2 M1.A1
N$181
  Top 0.254: JP9.3 M1.A2
N$182
  Top 0.254: JP9.4 M1.A3
RESET  (via drill 0.5)
  Top 0.254: RESET.A RESET.A' 15.79,44.49 v15.75,44.45 | M1.RESET JP7.6 | M1.RESET_ICSP 63.63,14.35 62.61,13.34 60.07,13.34 58.67,11.94 58.67,8.89 57.78,8 v47.37,8
  Bottom 0.254: v15.75,44.45 15.75,14.99 21.84,8.89 26.42,8.89 28.96,6.35 32.97,6.35 JP7.6 34.62,8 v47.37,8
SCK  (via drill 0.5)
  Top 0.254: 8.62,16.49 9.14,17.02 16.26,17.02 17.53,18.29 v17.53,22.23 | v63.5,42.29 37.97,42.29 37.08,41.4 | U2.7 36.96,39.37 37.08,39.5 37.08,41.4 | 37.08,41.4 34.04,41.4 32.89,40.26 32.51,40.26 32,40.77 32,41.15 31.37,41.78 v31.24,41.78
  Top 0.305: 8.62,16.49 8.57,16.44 R6.2
  Bottom 0.254: v17.53,22.23 17.53,41.4 19.56,43.43 SJ3.2 29.72,42.67 30.61,42.67 31.24,42.04 v31.24,41.78 | v63.5,42.29 64.01,41.78 64.01,34.16 61.72,31.88 61.72,28.57 62.48,27.81 63.5,27.81 M1.SCK
SCL  (via drill 0.5)
  Top 0.254: 30.99,6.86 30.35,6.22 IC1.6 28,6.35 v25.91,6.35 | 30.99,9.21 R1.2
  Top 0.305: 30.99,6.86 30.99,9.21
  Bottom 0.254: 43.69,52.58 19.3,52.58 18.8,52.07 M1.SCL JP1.10 | 42.55,13.08 62.61,13.08 63.37,12.32 v63.5,12.32 | v25.91,6.35 25.91,5.33 27.18,4.06 63.5,4.06 65.15,5.71 65.15,10.67 v63.5,12.32 | v63.5,12.32 SJ2.1
  Bottom 0.305: 42.55,13.08 36.07,12.95 34.67,14.35 34.67,28.07 37.21,30.61 37.21,41.02 37.85,41.66 39.62,41.66 44.07,46.1 44.07,52.2 43.69,52.58
SD_CD  (via drill 0.5)
  Top 0.254: U$2.CD 24.46,41.1 21.08,37.72 21.08,33.02 21.84,32.26 v23.11,32.26
  Bottom 0.254: v23.11,32.26 27.69,27.69 CN1.1
SD_CS
  Top 0.254: 30.35,40.77 30.35,42.8 30.73,43.18 R5.2
  Top 0.305: U2.9 30.35,40.77 | 30.73,43.18 30.73,43.81 30.86,43.94 38.61,43.94 JP5.1
  Bottom 0.305: SJ6.2 38.99,44.7 JP5.1
SD_CSIN  (via drill 0.5)
  Top 0.254: U2.10 28.83,39.37 28.83,34.8 28.57,34.42 22.99,34.42 v22.73,34.16 | v22.73,23.24 26.13,23.24 U$2.1
  Bottom 0.254: v22.73,34.16 21.84,33.27 21.84,30.99 22.73,30.1 v22.73,23.24
SD_DATAIN
  Top 0.254: U2.2 37.34,33.02 37.59,32.77 37.59,30.73 36.58,29.72 29.97,29.72 29.46,29.21 29.46,27.69 27.43,25.65 25.27,25.65 | 25.27,25.65 25.71,25.53 | U$2.2 25.32,25.7 25.27,25.65
SD_SCKIN
  Top 0.254: U$2.5 26.25,33.27 28.19,33.27 28.7,32.77 28.7,31.24 29.21,30.73 32.51,30.73 32.51,36.83 33.78,38.1 U2.6
SD_WP  (via drill 0.5)
  Top 0.254: U$2.WP 28.2,42.3 v28.83,41.66
  Bottom 0.254: 30.23,25.15 29.21,25.15 26.04,21.97 21.97,21.97 20.7,23.24 20.7,39.37 21.46,40.13 27.3,40.13 v28.83,41.66
  Bottom 0.305: 30.23,25.15 CN1.2
SDA  (via drill 0.5)
  Top 0.254: 32,8.13 31.75,7.87 31.75,6.6 30.1,4.95 IC1.5 28,4.83 26.16,4.83 25.91,4.57 v25.91,3.3 | 33.15,8.51 R2.2
  Top 0.305: 32,8.13 32.77,8.13 33.15,8.51
  Top 0.406: JP1.9 M1.SDA
  Bottom 0.254: 21.34,51.82 21.59,52.07 43.18,52.07 43.43,51.82 | 42.16,12.19 48.39,12.19 | 48.39,12.19 60.83,12.19 | v25.91,3.3 25.02,4.19 25.02,7.24 25.27,7.49 26.29,7.49 29.08,4.7 47.37,4.7 48.39,5.71 48.39,12.19 | 60.96,11.94 SJ1.1
  Bottom 0.305: 42.16,12.19 35.81,12.19 33.91,14.1 33.91,28.32 36.45,30.86 36.45,41.27 37.47,42.29 39.24,42.29 43.43,46.48 43.43,51.82 | 21.34,51.82 M1.SDA | 60.83,12.19 60.96,11.94
SQW  (via drill 0.5)
  Top 0.254: v29.97,7.87 29.59,7.49 IC1.7
  Bottom 0.254: v29.97,7.87 29.72,8.13
  Bottom 0.305: CN1.3 29.08,20.7 29.08,8.76 v29.97,7.87
VBAT
  Top 0.254: B1.+$1 19.91,6.22 IC1.3
VDDIO
  Top 0.254: SJ7.2 28.45,12.95 | R5.1 28.64,43.62 26.8,45.47 22.61,45.47 18.54,41.4 18.54,17.78 23.24,13.08 26.92,13.08
  Top 0.305: 31,11.18 31.05,11.18 R1.1
  Top 0.406: R2.1 R1.1 | 31,11.18 27.05,11.18 26.92,11.05 | SJ7.2 27.05,13.84 26.92,13.72 26.92,13.08 26.92,11.05 | 26.92,11.05 26.92,9.97 IC1.8

### Text on the board
tPlace: LED1 | LED2 | Reset | L2 | L1 | CS | Opt. LEDs | CD | WP | SQ | Open Drain | 3v | CR1220 | 3V | Vio | 5V | SD | PCF8523 | PWR | Datalogging | Arduino Shield | adafruit
bPlace: SCK | MISO | MOSI | Cut to change CS | Short SPI jumpers / on '328 Arduinos / without ICSP / connector | Short on '328s without SCL/SDA pins | SDA | SCL